# Altium schematic sheet ZP.SchDoc
size OrCAD A
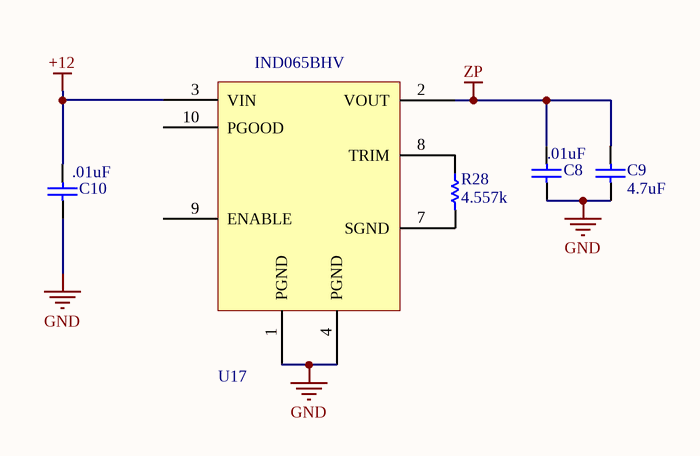
[diagram p0: ZP.SchDoc]

## Parts
C8  .01uF  [CAPC0805(2012)145_N]
C9  4.7uF  [CAPC1210(3225)170_N]
C10  .01uF  [CAPC0805(2012)145_N]
R28  4.557k  [RESC0805(2012)_L]
U17  IND065BHV  [IND065BHV]

## Nets
+12: C10.2 U17.3(VIN)
GND: C8.1 C9.1 C10.1 U17.1(PGND) U17.4(PGND)
ZP: C8.2 C9.2 U17.2(VOUT)
NetR28_1: R28.1 U17.8(TRIM)
NetR28_2: R28.2 U17.7(SGND)

Not connected (* = marked no-connect by the designer): U17 9(ENABLE) 10(PGOOD)

## Library data of the parts
C8 C10 = CMP-1036-04795-1: CAP CER 0.1UF 25V X7R 0805
C9 = CMP-1038-00473-1: CAP 4.7uF 100V ±2% 1210 (3225 Metric) Thickness 1.7mm SMD; Value: 680pF; Case-EIA: 1210; Case-Metric: 3225; Tolerance: Â±2%; Rated Voltage: 100 V; Max Thickness: 1.7 mm; Technology: SMT
R28 = CMP-1013-00215-1: RES SMD 56.2K OHM JUMPER 1/8W 0805